# Altium schematic sheet CCP_MCU_IO_CN11.SchDoc
size A
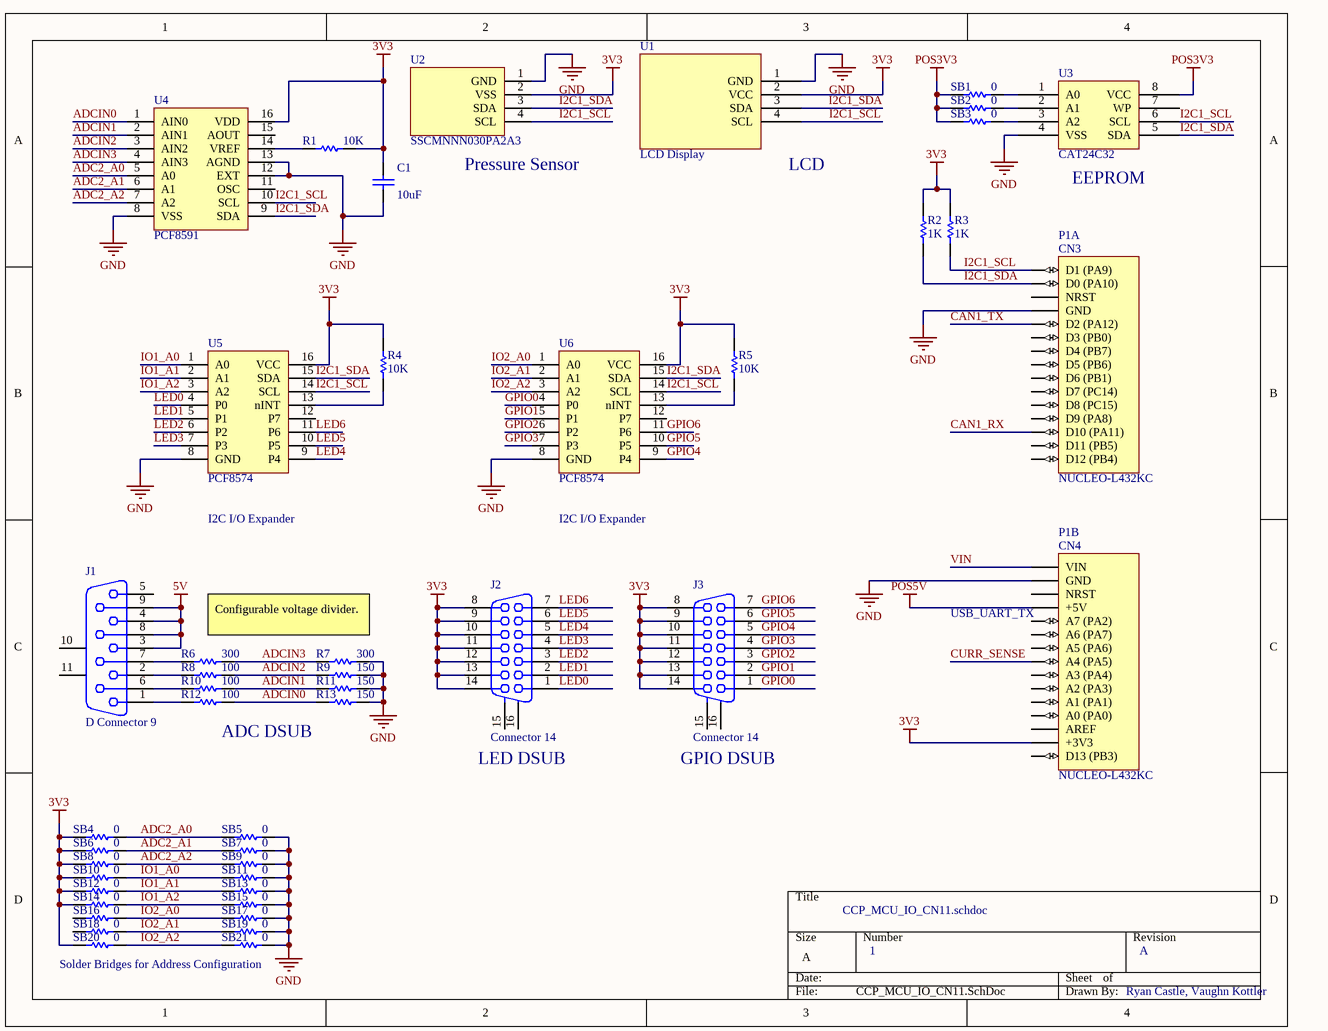
[diagram p0: CCP_MCU_IO_CN11.SchDoc]

## Parts
C1  value 10uF  [C1206]  (hidden comment: Cap)
J1  D Connector 9  [DSUB1.385-2H9]
J2  Connector 14  [CHAMP1.27-2H14A]
J3  Connector 14  [CHAMP1.27-2H14A]
P1  NUCLEO-L432KC  [NUCLEO-32]  (parts A,B of 2)
R1  value 10K  [6-0805_M]  (hidden comment: Res1)
R2  value 1K  [6-0805_M]  (hidden comment: Res1)
R3  value 1K  [6-0805_M]  (hidden comment: Res1)
R4  value 10K  [6-0805_M]  (hidden comment: Res1)
R5  value 10K  [6-0805_M]  (hidden comment: Res1)
R6  value 300  [6-0805_M]  (hidden comment: Res1)
R7  value 300  [6-0805_M]  (hidden comment: Res1)
R8  value 100  [6-0805_M]  (hidden comment: Res1)
R9  value 150  [6-0805_M]  (hidden comment: Res1)
R10  value 100  [6-0805_M]  (hidden comment: Res1)
R11  value 150  [6-0805_M]  (hidden comment: Res1)
R12  value 100  [6-0805_M]  (hidden comment: Res1)
R13  value 150  [6-0805_M]  (hidden comment: Res1)
SB1  value 0  [6-0805_M]  (hidden comment: Res1)
SB2  value 0  [6-0805_M]  (hidden comment: Res1)
SB3  value 0  [6-0805_M]  (hidden comment: Res1)
SB4  value 0  [6-0805_M]  (hidden comment: Res1)
SB5  value 0  [6-0805_M]  (hidden comment: Res1)
SB6  value 0  [6-0805_M]  (hidden comment: Res1)
SB7  value 0  [6-0805_M]  (hidden comment: Res1)
SB8  value 0  [6-0805_M]  (hidden comment: Res1)
SB9  value 0  [6-0805_M]  (hidden comment: Res1)
SB10  value 0  [6-0805_M]  (hidden comment: Res1)
SB11  value 0  [6-0805_M]  (hidden comment: Res1)
SB12  value 0  [6-0805_M]  (hidden comment: Res1)
SB13  value 0  [6-0805_M]  (hidden comment: Res1)
SB14  value 0  [6-0805_M]  (hidden comment: Res1)
SB15  value 0  [6-0805_M]  (hidden comment: Res1)
SB16  value 0  [6-0805_M]  (hidden comment: Res1)
SB17  value 0  [6-0805_M]  (hidden comment: Res1)
SB18  value 0  [6-0805_M]  (hidden comment: Res1)
SB19  value 0  [6-0805_M]  (hidden comment: Res1)
SB20  value 0  [6-0805_M]  (hidden comment: Res1)
SB21  value 0  [6-0805_M]  (hidden comment: Res1)
U1  LCD Display  [4POS TERM BLOCK]
U2  SSCMNNN030PA2A3  [8-SMT]
U3  CAT24C32  [SO8_N]
U4  PCF8591  [16-SOIC]
U5  PCF8574  [16-SOIC]
U6  PCF8574  [16-SOIC]

## Nets
3V3: C1.2 J2.8 J2.9 J2.10 J2.11 J2.12 J2.13 J2.14 J3.8 J3.9 J3.10 J3.11 J3.12 J3.13 J3.14 P1.17(+3V3) R1.1 R2.2 R3.2 R4.2 R5.2 SB4.2 SB6.2 SB8.2 SB10.2 SB12.2 SB14.2 SB20.2 U1.2(VCC) U2.2(VSS) U4.16(VDD) U5.16(VCC) U6.16(VCC)
5V: J1.3 J1.4 J1.8 J1.9
GND: C1.1 P1.4(GND) P1.29(GND) R7.1 R9.1 R11.1 R13.1 SB5.1 SB7.1 SB9.1 SB11.1 SB13.1 SB15.1 SB17.1 SB19.1 SB21.1 U1.1(GND) U2.1(GND) U3.4(VSS) U4.8(VSS) U4.12(EXT) U4.13(AGND) U5.8(GND) U6.8(GND)
POS3V3: SB1.2 SB2.2 SB3.2 U3.8(VCC)
POS5V: P1.27(+5V)
ADC2_A0: SB4.1 SB5.2 U4.5(A0)
ADC2_A1: SB6.1 SB7.2 U4.6(A1)
ADC2_A2: SB8.1 SB9.2 U4.7(A2)
ADCIN0: R12.1 R13.2 U4.1(AIN0)
ADCIN1: R10.1 R11.2 U4.2(AIN1)
ADCIN2: R8.1 R9.2 U4.3(AIN2)
ADCIN3: R6.1 R7.2 U4.4(AIN3)
CAN1_RX: P1.13(D10_(PA11))
CAN1_TX: P1.5(D2_(PA12))
CURR_SENSE: P1.23(A4_(PA5))
GPIO0: J3.1 U6.4(P0)
GPIO1: J3.2 U6.5(P1)
GPIO2: J3.3 U6.6(P2)
GPIO3: J3.4 U6.7(P3)
GPIO4: J3.5 U6.9(P4)
GPIO5: J3.6 U6.10(P5)
GPIO6: J3.7 U6.11(P6)
I2C1_SCL: P1.1(D1_(PA9)) R3.1 U1.4(SCL) U2.4(SCL) U3.6(SCL) U4.10(SCL) U5.14(SCL) U6.14(SCL)
I2C1_SDA: P1.2(D0_(PA10)) R2.1 U1.3(SDA) U2.3(SDA) U3.5(SDA) U4.9(SDA) U5.15(SDA) U6.15(SDA)
IO1_A0: SB10.1 SB11.2 U5.1(A0)
IO1_A1: SB12.1 SB13.2 U5.2(A1)
IO1_A2: SB14.1 SB15.2 U5.3(A2)
IO2_A0: SB16.1 SB17.2 U6.1(A0)
IO2_A1: SB18.1 SB19.2 U6.2(A1)
IO2_A2: SB20.1 SB21.2 U6.3(A2)
LED0: J2.1 U5.4(P0)
LED1: J2.2 U5.5(P1)
LED2: J2.3 U5.6(P2)
LED3: J2.4 U5.7(P3)
LED4: J2.5 U5.9(P4)
LED5: J2.6 U5.10(P5)
LED6: J2.7 U5.11(P6)
VIN: P1.30(VIN)
NetJ1_1: J1.1 R12.2
NetJ1_2: J1.2 R8.2
NetJ1_6: J1.6 R10.2
NetJ1_7: J1.7 R6.2
NetR1_2: R1.2 U4.14(VREF)
NetR4_1: R4.1 U5.13(nINT)
NetR5_1: R5.1 U6.13(nINT)
NetSB1_1: SB1.1 U3.1(A0)
NetSB2_1: SB2.1 U3.2(A1)
NetSB3_1: SB3.1 U3.3(A2)

Not connected (* = marked no-connect by the designer): J1 5 10(MH1) 11(MH2); J2 15(MH1) 16(MH2); J3 15(MH1) 16(MH2); P1 3(NRST) 6(D3_(PB0)) 7(D4_(PB7)) 8(D5_(PB6)) 9(D6_(PB1)) 10(D7_(PC14)) 11(D8_(PC15)) 12(D9_(PA8)) 14(D11_(PB5)) 15(D12_(PB4)) 16(D13_(PB3)) 18(AREF) 19(A0_(PA0)) 20(A1_(PA1)) 21(A2_(PA3)) 22(A3_(PA4)) 24(A5_(PA6)) 25(A6_(PA7)) 26(A7_(PA2)) 28(NRST); SB16 2; SB18 2; U3 7(WP); U4 11(OSC) 15(AOUT); U5 12(P7); U6 12(P7)

## Notes on the sheet
- (near U2) Pressure Sensor
- (near U1) LCD
- (near U3) EEPROM
- I2C I/O Expander
- Configurable voltage divider.
- (near P1) USB_UART_TX
- ADC DSUB
- (near J2) LED DSUB
- (near J3) GPIO DSUB
- CCP_MCU_IO_CN11.schdoc
- Solder Bridges for Address Configuration
- 1
- A
- Ryan Castle, Vaughn Kottler
- (in symbol NUCLEO-L432KC, part A) CN3
- (in symbol NUCLEO-L432KC, part B) CN4

## Library data of the parts
C1 = Cap: Capacitor; Published: 8-Jun-2000; LatestRevisionDate: 17-Jul-2002; LatestRevisionNote: Re-released for DXP Platform.; PackageReference: RAD-0.3; Publisher: Altium Limited; PackageDescription: Radial Cap, Thru-Hole; 2 Leads; 0.3 in Pin Spacing
J1 = D Connector 9: Receptacle Assembly, 9 Position, Right Angle; PackageDocument: O; Positions: 9; Published: 15-Jun-2001; LatestRevisionDate: 17-Jul-2002; LatestRevisionNote: Re-released for DXP Platform.; DatasheetDocument: 1-Sep-1999; PackageReference: 788750; Publisher: Altium Limited; Orientation: Right Angle; Gender: Receptacle
J2 J3 = Connector 14: Receptacle Header Assemby; PackageDocument: B; Positions: 14; Published: 15-Jun-2001; LatestRevisionDate: 17-Jul-2002; LatestRevisionNote: Re-released for DXP Platform.; DatasheetDocument: 1-Oct-1983; PackageReference: 178240-1; Publisher: Altium Limited; Orientation: Right Angle
P1 = NUCLEO-L432KC: STM32L432KC Development Board; ComponentLink1Description: MBED; ComponentLink1URL: https://os.mbed.com/platforms/ST-Nucleo-L432KC/; ComponentLink2Description: Digikey; ComponentLink2URL: https://www.digikey.com/products/en?keywords=NUCLEO-L432KC
R1-R13 SB1-SB21 = Res1: Resistor; Published: 8-Jun-2000; LatestRevisionDate: 17-Jul-2002; LatestRevisionNote: Re-released for DXP Platform.; PackageReference: AXIAL-0.3; Publisher: Altium Limited; PackageDescription: Axial Device, Thru-Hole; 2 Leads; 0.3 in Pin Spacing
U1 = B01LC8HZ2O: ComponentLink1Description: Part; ComponentLink1URL: https://www.amazon.in/Industry-Interface-Display-Character-MEGA2560/dp/B01LC8HZ2O
U2 = SSCMNNN030PA2A3: Honeywell Digital Pressure Sensor; ComponentLink1Description: Part; ComponentLink1URL: https://www.digikey.com/product-detail/en/honeywell-sensing-and-productivity-solutions/SSCMNNN030PA2A3/480-6407-ND/2416123; ComponentLink2Description: Datasheet; ComponentLink2URL: https://sensing.honeywell.com/index.php?ci_id=151134
U3 = CAT24C32: I2C EEPROM; ComponentLink1Description: Part; ComponentLink1URL: https://www.digikey.com/product-detail/en/on-semiconductor/CAT24C32WI-GT3/CAT24C32WI-GT3CT-ND/1631159; ComponentLink2Description: Datasheet; ComponentLink2URL: http://www.onsemi.com/pub/Collateral/CAT24C32-D.PDF
U4 = PCF8591: 8-bit A/D and D/A; ComponentLink1Description: Part; ComponentLink1URL: https://www.digikey.com/product-detail/en/nxp-usa-inc/PCF8591T-2518/568-1088-1-ND/735798; ComponentLink2Description: Datasheet; ComponentLink2URL: https://www.nxp.com/docs/en/data-sheet/PCF8591.pdf
U5 U6 = PCF8574: I2C I/O Expander; ComponentLink1Description: Part; ComponentLink1URL: https://www.digikey.com/product-detail/en/texas-instruments/PCF8574DWR/296-13108-1-ND/484579; ComponentLink2Description: Datasheet; ComponentLink2URL: http://www.ti.com/lit/ds/symlink/pcf8574.pdf